# Altium schematic sheet mcu.SchDoc
size A4
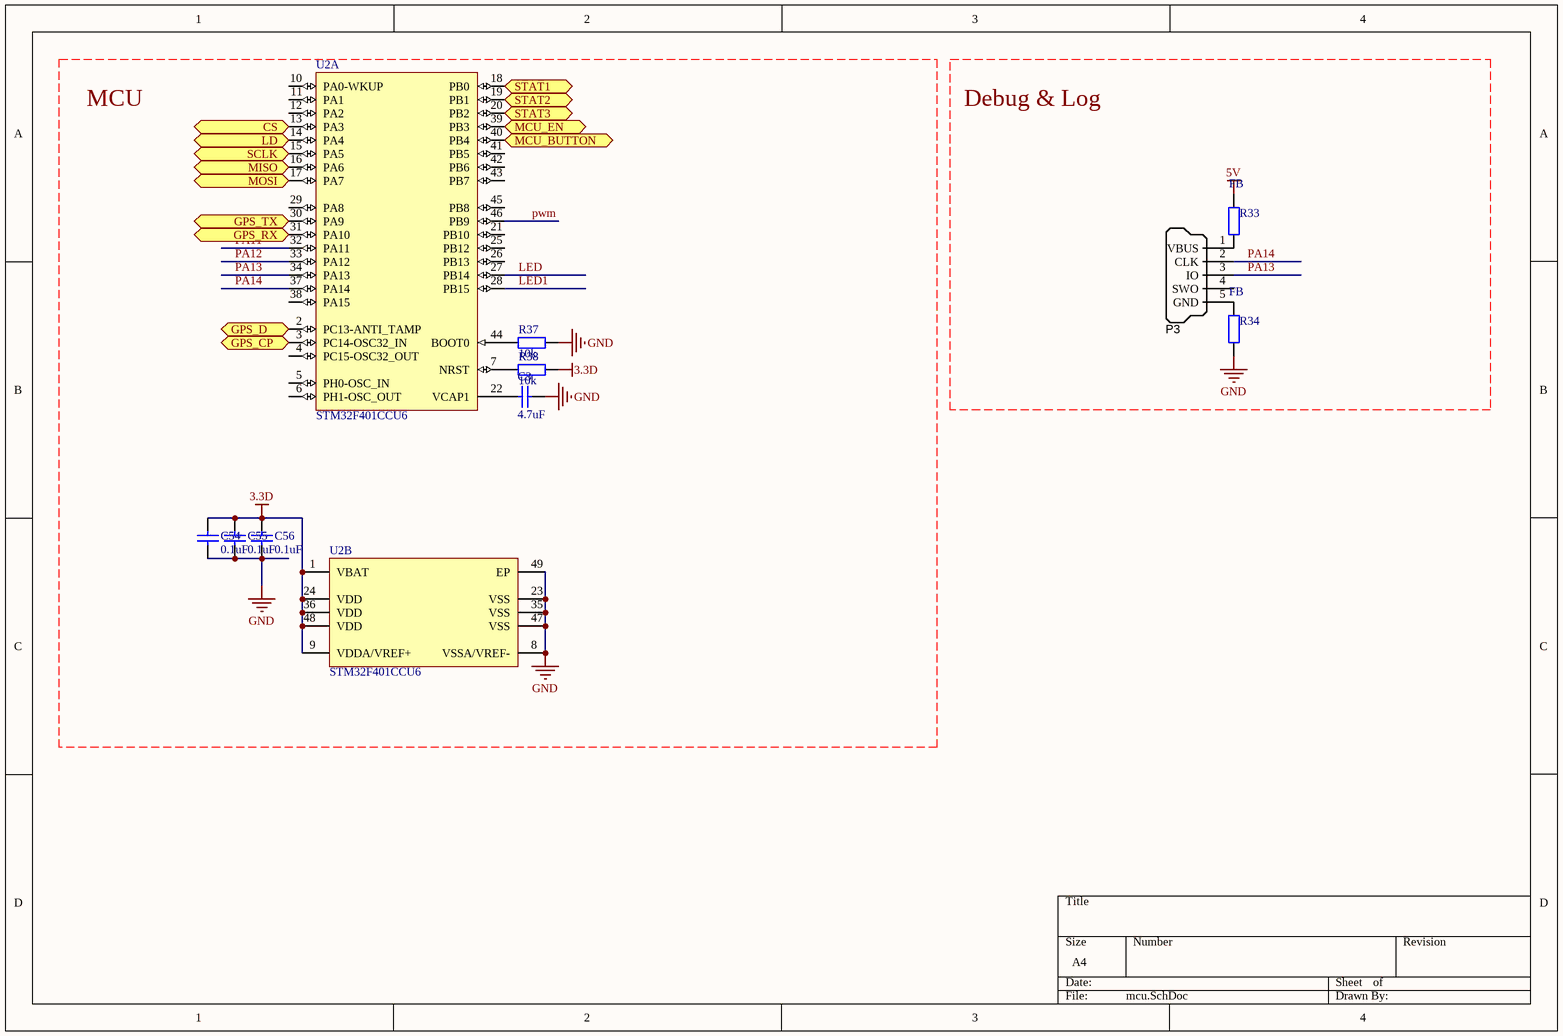
[diagram p0: mcu.SchDoc]

## Parts
C3  value 4.7uF  [0603]  (hidden comment: Cap)
C54  value 0.1uF  [0402]  (hidden comment: Cap)
C55  value 0.1uF  [0402]  (hidden comment: Cap)
C56  value 0.1uF  [0402]  (hidden comment: Cap)
P3  SWD_MicroUSB  [MICRO-YZX]  (value not drawn)
R33  FB  [0603L]
R34  FB  [0603L]
R37  value 10k  [0402]  (hidden comment: Res2)
R38  value 10k  [0402]  (hidden comment: Res2)
U2  STM32F401CCU6  [STM-UFQFPN48_N]  (parts A,B of 2)

## Ports
CS, GPS_CP, GPS_D, GPS_RX, GPS_TX, LD, MCU_BUTTON, MCU_EN, MISO, MOSI, SCLK, STAT1, STAT2, STAT3

## Nets
3.3D: C54.2 C55.2 C56.2 R38.1 U2.1(VBAT) U2.9(VDDA/VREF+) U2.24(VDD) U2.36(VDD) U2.48(VDD)
5V: R33.2
GND: C3.1 C54.1 C55.1 C56.1 R34.1 R37.2 U2.8(VSSA/VREF-) U2.23(VSS) U2.35(VSS) U2.47(VSS) U2.49(EP)
CS: U2.13(PA3) ; port CS
GPS_CP: U2.3(PC14-OSC32_IN) ; port GPS_CP
GPS_D: U2.2(PC13-ANTI_TAMP) ; port GPS_D
GPS_RX: U2.31(PA10) ; port GPS_RX
GPS_TX: U2.30(PA9) ; port GPS_TX
LD: U2.14(PA4) ; port LD
LED: U2.27(PB14)
LED1: U2.28(PB15)
MCU_BUTTON: U2.40(PB4) ; port MCU_BUTTON
MCU_EN: U2.39(PB3) ; port MCU_EN
MISO: U2.16(PA6) ; port MISO
MOSI: U2.17(PA7) ; port MOSI
PA11: U2.32(PA11)
PA12: U2.33(PA12)
PA13: P3.3(IO) U2.34(PA13)
PA14: P3.2(CLK) U2.37(PA14)
pwm: U2.46(PB9)
SCLK: U2.15(PA5) ; port SCLK
STAT1: U2.18(PB0) ; port STAT1
STAT2: U2.19(PB1) ; port STAT2
STAT3: U2.20(PB2) ; port STAT3
NetC3_2: C3.2 U2.22(VCAP1)
NetP3_1: P3.1(VBUS) R33.1
NetP3_5: P3.5(GND) R34.2
NetR37_1: R37.1 U2.44(BOOT0)
NetR38_2: R38.2 U2.7(NRST)

Not connected (* = marked no-connect by the designer): P3 4(SWO); U2 4(PC15-OSC32_OUT) 5(PH0-OSC_IN) 6(PH1-OSC_OUT) 10(PA0-WKUP) 11(PA1) 12(PA2) 21(PB10) 25(PB12) 26(PB13) 29(PA8) 38(PA15) 41(PB5) 42(PB6) 43(PB7) 45(PB8)

## Notes on the sheet
- MCU
- Debug & Log

## Library data of the parts
C3 C54-C56 = Cap: Capacitor; Published: 8-Jun-2000; LatestRevisionDate: 17-Jul-2002; LatestRevisionNote: Re-released for DXP Platform.; PackageReference: RAD-0.3; Publisher: Altium Limited; PackageDescription: Radial Cap, Thru-Hole; 2 Leads; 0.3 in Pin Spacing
P3 = SWD_MicroUSB: Connector SMD USB Micro Type B middle mount; Manufacturer 1: Molex Inc; SCDType: undef; Package / Case: SMD; Supplier 1: Digi-Key; Supplier Part Number 1: WM17142CT-ND
R33 R34 R37 R38 = Res2: Resistor; Published: 8-Jun-2000; LatestRevisionDate: 17-Jul-2002; LatestRevisionNote: Re-released for DXP Platform.; PackageReference: AXIAL-0.4; Publisher: Altium Limited; PackageDescription: Axial Device, Thru-Hole; 2 Leads; 0.4 in Pin Spacing
U2 = STM32F401CCU6: ARM Cortex-M4 32-bit MCU+FPU, 105 DMIPS, 256 kB Flash, 64 kB Internal RAM, 36 I/Os, 48-pin UFQFPN, -40 to 85 degC, Tray; Manufacturer: STMicroelectronics; FLASH Size (Prog) (kB): 256; I/Os (High Current): 36; Internal RAM Size (kB): 64; Operating Frequency(F) (Processor speed) (MHz): 84; Supply Voltage(Vcc) max (V): 3.6; Supply Voltage(Vcc) min (V): 1.8; DatasheetVersion: Rev. 1; PackageVersion: Rev. 1, 04/2013; PackageReference: UFQFPN48; PackageDescription: 48-Pin Ultra Thin Fine Pitch Quad Flat No-Lead, 7 x 7 x 0.6 mm Body, 0.5 mm Pitch, Exposed Pad; Supplier 1: Newark; Supplier Part Number 1: 19X6217; Supplier 2: Mouser; Supplier Part Number 2: 511-STM32F401CCU6; Core: ARM Cortex-M4; Packing: Tray; Mounting Technology: Surface Mount; PartNumber: STM32F401CCU6; ComponentLink1Description: Manufacturer URL; ComponentLink1URL: http://www.st.com/web/en/home.html; ComponentLink2Description: Datasheet; ComponentLink2URL: http://www.st.com/st-web-ui/static/active/en/resource/technical/document/data_brief/DM00071938.pdf; ComponentLink3Description: Package Specification; ComponentLink3URL: http://www.st.com/st-web-ui/static/active/en/resource/technical/document/data_brief/DM00071938.pdf